# EAGLE schematic ScienceDuino (EAGLE 8.7.0)
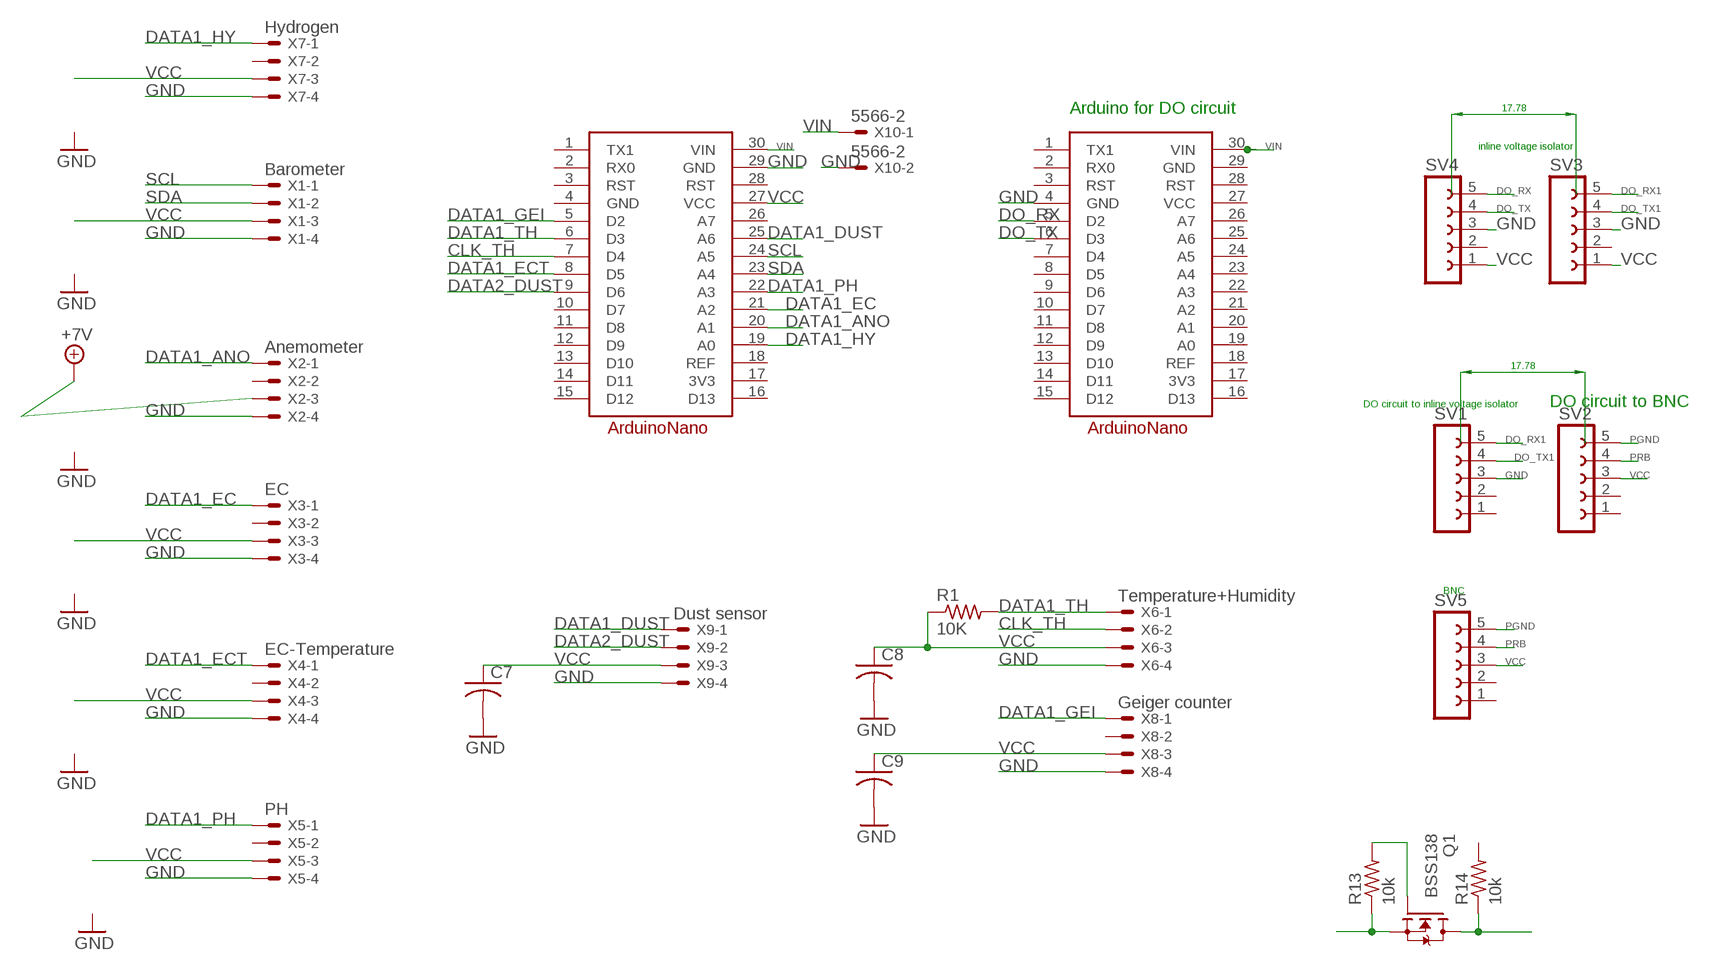
[diagram p0: schematic, sheet 1]

## Parts
A1  ARDUINONANO  [ARDUINONANO]
A2  ARDUINONANO  [ARDUINONANO]
C7  C-USC1206  [C1206]
C8  C-USC1206  [C1206]
C9  C-USC1206  [C1206]
Q1  BSS138  [SOT23]
R1  10K  R-US_0204/5  [0204/5]
R13  10k  R-US_R1206  [R1206]
R14  10k  R-US_R1206  [R1206]
SV1  FE05-1  [FE05-1]
SV2  FE05-1  [FE05-1]
SV3  FE05-1  [FE05-1]
SV4  FE05-1  [FE05-1]
SV5  FE05-1  [FE05-1]
X1  Barometer  5566-4  [5566-4]
X2  Anemometer  5566-4  [5566-4]
X3  EC  5566-4  [5566-4]
X4  EC-Temperature  5566-4  [5566-4]
X5  PH  5566-4  [5566-4]
X6  Temperature+Humidity  5566-4  [5566-4]
X7  Hydrogen  5566-4  [5566-4]
X8  Geiger counter  5566-4  [5566-4]
X9  Dust sensor  5566-4  [5566-4]
X10  5566-2  [5566-2]

## Nets
3.3: Q1.1(G) R13.2
+7V: X2.3
CLK_TH: A1.7(D4) X6.2
DATA1_ANO: A1.20(A1) X2.1
DATA1_DUST: A1.25(A6) X9.1
DATA1_EC: A1.21(A2) X3.1
DATA1_ECT: A1.8(D5) X4.1
DATA1_GEI: A1.5(D2) X8.1
DATA1_HY: A1.19(A0) X7.1
DATA1_PH: A1.22(A3) X5.1
DATA1_TH: A1.6(D3) R1.2 X6.1
DATA2_DUST: A1.9(D6) X9.2
DO_RX: A2.5(D2) SV4.5
DO_RX1: SV1.5 SV3.5
DO_TX: A2.6(D3) SV4.4
DO_TX1: SV1.4 SV3.4
GND: A1.29(GND) A2.4(GND) C7.2 C8.2 C9.2 SV1.3 SV3.3 SV4.3 X1.4 X2.4 X3.4 X4.4 X5.4 X6.4 X7.4 X8.4 X9.4 X10.2
PGND: SV2.5 SV5.5
PRB: SV2.4 SV5.4
SCL: A1.24(A5) Q1.2(S) R13.1 X1.1
SCL_HV: Q1.3(D) R14.1
SDA: A1.23(A4) X1.2
VCC: A1.27(VCC) C7.1 C8.1 C9.1 R1.1 SV2.3 SV3.1 SV4.1 SV5.3 X1.3 X3.3 X4.3 X5.3 X6.3 X7.3 X8.3 X9.3
VIN: A1.30(VIN) A2.30(VIN) X10.1
Unconnected: A1.1(TX1) A1.2(RX0) A1.3(RST) A1.10(D7) A1.11(D8) A1.12(D9) A1.13(D10) A1.14(D11) A1.15(D12) A1.16(D13) A1.26(A7) A1.28(RST) A2.1(TX1) A2.2(RX0) A2.3(RST) A2.7(D4) A2.8(D5) A2.9(D6) A2.10(D7) A2.11(D8) A2.12(D9) A2.13(D10) A2.14(D11) A2.15(D12) A2.16(D13) A2.19(A0) A2.20(A1) A2.21(A2) A2.22(A3) A2.23(A4) A2.24(A5) A2.25(A6) A2.26(A7) A2.28(RST) R14.2 SV1.1 SV1.2 SV2.1 SV2.2 SV3.2 SV4.2 SV5.1 SV5.2 X2.2 X3.2 X4.2 X5.2 X7.2 X8.2

## Notes on the sheet
- Arduino for DO circuit
- inline voltage isolator
- DO circuit to inline voltage isolator | DO circuit to BNC
- BNC

## Power pins joined to a net without a drawn wire
3V3: A1.17(3V3) A2.17(3V3)
GND: A1.4(GND) A2.29(GND)
REF: A1.18(REF) A2.18(REF)
VCC: A2.27(VCC)

## Library data of the parts
A1 A2 = ArduinoNano:ARDUINONANO
C7-C9 = rcl:C-US: CAPACITOR, American symbol; SPICEPREFIX: C
Q1 = bss138_10:BSS138: BSS138 N-Channel Logic Level Enhancement Mode Field Effect Transistor Source: http://www.fairchildsemi.com/datasheets/BS/BSS138.pdf; MF: Fairchild; MPN: BSS138; OC_FARNELL: 9845330; OC_NEWARK: 67R2009
R1 = resistor:R-US_: RESISTOR, American symbol
R13 R14 = rcl:R-US_: RESISTOR, American symbol; SPICEPREFIX: R
SV1-SV5 = con-lsta:FE05-1: FEMALE HEADER; OC_FARNELL: unknown; OC_NEWARK: unknown
X1-X9 = con-molex:5566-4: Mini FIT connector 4 pol Source: http://www.molex.com; MF: MOLEX; OC_FARNELL: unknown; OC_NEWARK: unknown
X10 = con-molex:5566-2: Mini FIT connector 2 pol Source: http://www.molex.com; MF: MOLEX; OC_FARNELL: 1822072; OC_NEWARK: unknown